# Altium schematic sheet Sheet_1_2022-01-05.schdoc
size 53 x 35 mm
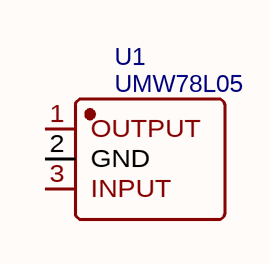
[diagram p0: Sheet_1_2022-01-05.schdoc]

## Parts
U1  UMW78L05  [SOT-89-3_L4.5-W2.5-P1.50-LS4.2-BR]

## Nets

Not connected (* = marked no-connect by the designer): U1 1(OUTPUT) 2(GND) 3(INPUT)

## Library data of the parts
U1 = UMW78L05: BOM_Manufacturer: Youtai Semiconductor Co., Ltd.; Contributor: LCSC; BOM_Supplier: LCSC; BOM_Supplier Part: C347258; BOM_Manufacturer Part: UMW78L05; BOM_JLCPCB Part Class: Extended Part; spicePre: U; spiceSymbolName: UMW78L05